# Altium project si4735_RX_MIET.PrjPcb
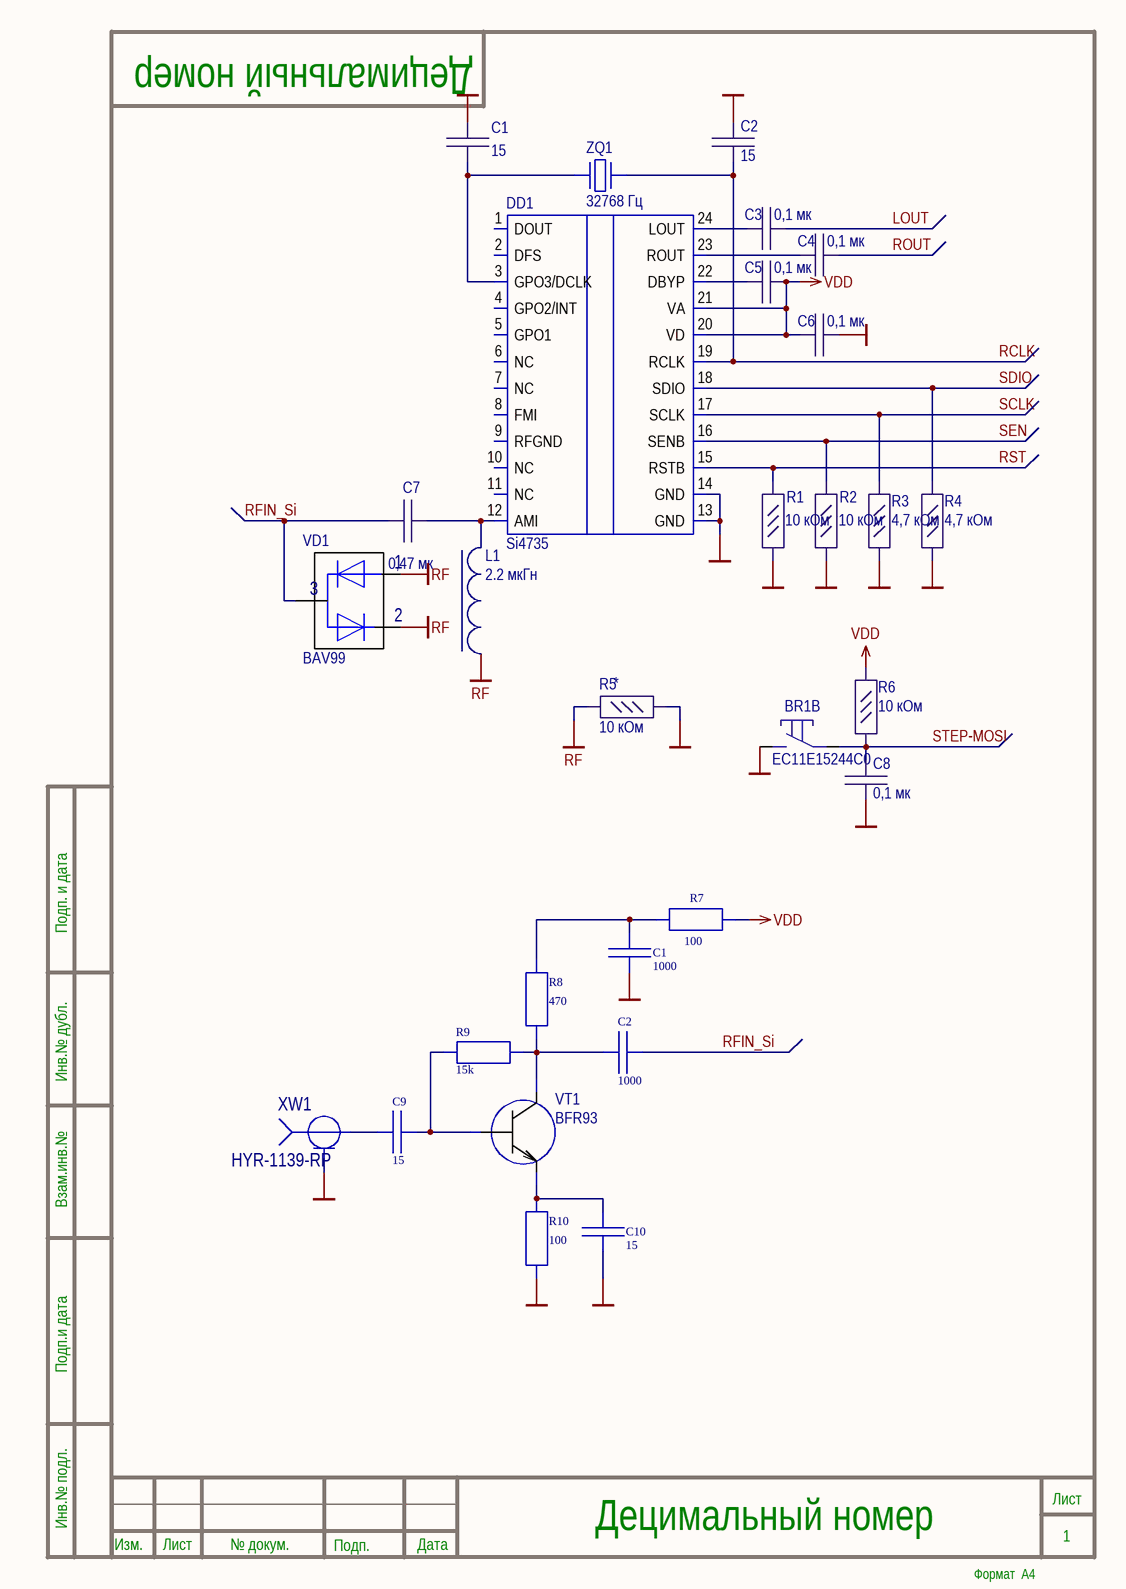
[diagram p0: RF.SchDoc]
5 sheets, 77 parts. Net scope: global (net labels, ports and power ports of the same name join across sheets).
Board file: PCB1.PcbDoc
Sheets:
  MAIN.SchDoc
  RF.SchDoc
  MCU.SchDoc
  AUDIO.SchDoc
  PWR.SchDoc

## Sheet MAIN.SchDoc: Наименование
size 209 x 297 mm; ApprovedBy: Утвердил; CheckedBy: Проверил; Author: Разработал; CompanyName: Организация; DrawnBy: Н.Контр; Engineer: Т.Контр; SheetNumber: 1; SheetTotal: 1; PageSetup: Record=PageOptions|CenterHorizontal=True|CenterVertical=True|PrintScale=0.94|XCorrection=1.00|YCorrection=1.00|PrintKind=1|BorderSize=5000000|LeftOffset=0|BottomOffset=0|Orientation=1|PaperLength=1000|PaperWidth=1000|Scale=100|PaperSource=7|PrintQuality=-4|MediaType=1|DitherType=10|PaperKind=A4|PrintScaleMode=1; DecimalNumber: Децимальный номер; HeadOfSector: Нач. сектора; MainDevice: Перв.примен.; Name: Наименование; DocumentName: Sheet1.SCHDOC

### Notes on the sheet
- Перв.примен.
- Справ.№
- Подп. и дата
- Инв.№ дубл.
- Взам.инв.№
- Подп.и дата
- Разраб.
- Изм.
- Лист
- № докум.
- Подп.
- Дата
- Лит.
- Масштаб
- Масса
- Т.контр.
- Пров.
- ПРИНЦИПИАЛЬНАЯ
- СХЕМА   ЭЛЕКТРИЧЕСКАЯ
- Листов
- Инв.№ подл.
- Утв.
- Н.контр.
- Нач.сект.
- Копировал
- Формат  A3

## Sheet RF.SchDoc: Наименование
size 209 x 297 mm; ApprovedBy: Утвердил; CheckedBy: Проверил; Author: Разработал; CompanyName: Организация; DrawnBy: Н.Контр; Engineer: Т.Контр; SheetNumber: 1; SheetTotal: 1; PageSetup: Record=PageOptions|CenterHorizontal=True|CenterVertical=True|PrintScale=0.94|XCorrection=1.00|YCorrection=1.00|PrintKind=1|BorderSize=5000000|LeftOffset=0|BottomOffset=0|Orientation=1|PaperLength=1000|PaperWidth=1000|Scale=100|PaperSource=7|PrintQuality=-4|MediaType=1|DitherType=10|PaperKind=A4|PrintScaleMode=1; DecimalNumber: Децимальный номер; HeadOfSector: Нач. сектора; MainDevice: Перв.примен.; Name: Наименование; DocumentName: Sheet1.SCHDOC

### Parts
BR1  EC11E15244C0  [EC11]  (part B of 2)
C1  15  [C_0603]
C2  15  [C_0603]
C3  0,1 мк  [C_0603]
C4  0,1 мк  [C_0603]
C5  0,1 мк  [C_0603]
C6  0,1 мк  [C_0603]
C7  0,47 мк  [C_0603]
C8  0,1 мк  [C_0603]
C9  15  [C_0603]
C10  15  [C_0603]
DD1  Si4735  [SSOP-24]
L1  2.2 мкГн  [LQW18A]
R1  10 кОм  [R_0603]
R2  10 кОм  [R_0603]
R3  4,7 кОм  [R_0603]
R4  4,7 кОм  [R_0603]
R5  10 кОм  [R_0603]
R6  10 кОм  [R_0603]
R7  100  [R_0603]
R8  470  [R_0603]
R9  15k  [R_0603]
R10  100  [R_0603]
VD1  BAV99  [SOT23]
VT1  BFR93  [BFR93 SOT95P230X110-3L]
XW1  HYR-1139-RP  [SMA (HYR1139)]
ZQ1  32768 Гц  [DT-38T]
С1  1000  [C_0603]
С2  1000  [C_0603]

### Nets
GND: BR1.D C1.2 C2.2 C6.1 C8.2 C10.1 DD1.13(GND) DD1.14(GND) R1.1 R2.1 R3.1 R4.1 R5.1 R10.1 XW1.1 С1.1
RF: L1.1 R5.2 VD1.1(A1) VD1.2(C2)
VDD: C5.1 C6.2 DD1.20(VD) DD1.21(VA) R6.1 R7.2
LOUT: C3.1
RCLK: C2.1 DD1.19(RCLK) ZQ1.1
RFIN_Si: C7.1 VD1.3(C1A2) С2.1
ROUT: C4.1
RST: DD1.15(RSTB) R1.2
SCLK: DD1.17(SCLK) R3.2
SDIO: DD1.18(SDIO) R4.2
SEN: DD1.16(SENB) R2.2
STEP-MOSI: BR1.E C8.1 R6.2
NetC1_1: C1.1 DD1.3(GPO3/DCLK) ZQ1.2
NetC3_2: C3.2 DD1.24(LOUT)
NetC4_2: C4.2 DD1.23(ROUT)
NetC5_2: C5.2 DD1.22(DBYP)
NetC7_2: C7.2 DD1.12(AMI) L1.2
NetC9_1: C9.1 XW1.2
NetC9_2: C9.2 R9.1 VT1.1(B)
NetC10_2: C10.2 R10.2 VT1.2(E)
NetR7_1: R7.1 R8.2 С1.2
NetR8_1: R8.1 R9.2 VT1.3(C) С2.2

Not connected (* = marked no-connect by the designer): DD1 1(DOUT) 2(DFS) 4(GPO2/INT) 5(GPO1) 6(NC) 7(NC) 8(FMI) 9(RFGND) 10(NC) 11(NC)

### Notes on the sheet
- (near R5) *
- Подп. и дата
- Инв.№ дубл.
- Взам.инв.№
- Подп.и дата
- Инв.№ подл.
- Изм.
- Лист
- № докум.
- Подп.
- Дата
- Формат  A4

### Library data of the parts
C1 C2 = GRM1885C1H150FA01D: CAP CER 15PF 50V C0G/NP0 0603; Manufacturer: Murata Electronics; Part Number: GRM1885C1H150FA01D; Value: 15pF; ComponentLink1URL: https://www.murata.com/~/media/webrenewal/support/library/catalog/products/capacitor/mlcc/c02e.ashx?la=en-us; ComponentLink1Description: Datasheet; Component Type: Capasitor
C3-C6 C8 = GRM188R72A104MA35D: CAP CER 0.1UF 100V X7R 0603; Manufacturer: Murata Electronics; Value: 0.1µF; Part Number: GRM188R72A104MA35D; ComponentLink1URL: https://search.murata.co.jp/Ceramy/image/img/A01X/G101/ENG/GRM188R72A104MA35-01.pdf; ComponentLink1Description: Datasheet; Component Type: Capasitor
C7 = GRM188R71E474KA12D: CAP CER 0.47UF 25V X7R 0603; Manufacturer: Murata Electronics; Value: 0.47µF; Part Number: GRM188R71E474KA12D; ComponentLink1URL: https://www.murata.com/~/media/webrenewal/support/library/catalog/products/capacitor/mlcc/c02e.ashx?la=en-us; ComponentLink1Description: Datasheet; Component Type: Capasitor
C9 C10 = 06035C100KAT2A: Cap. 15 pF, 0603
DD1 = Si4735: BROADCAST AM/FM/SW/LW RADIO RECEIVER
L1 = LQW18ANR22G: 0.22 мкГн, 0603, 2%
R1 R2 R5 R6 = CR0603-FX-1002ELF: RES SMD 10K OHM 1% 1/10W 0603; Manufacturer: Bourns Inc.; Part Number: CR0603-FX-1002ELF; Value: 10 кОм; ComponentLink1URL: https://www.bourns.com/pdfs/chpreztr.pdf; ComponentLink1Description: Datasheet; Component Type: Resistor
R3 R4 = CR0603-FX-4701ELF: RES SMD 4.7K OHM 1% 1/10W 0603; Manufacturer: Bourns Inc.; Part Number: CR0603-FX-4701ELF; Value: 4,7 кОм; ComponentLink1URL: https://www.bourns.com/pdfs/chpreztr.pdf; ComponentLink1Description: Datasheet; Component Type: Resistor
R7 R10 = CR0603-FX-1000ELF: Res. 100 Ohm, 0603
R8 = RC0603JR-07470RL: Res. 470 Ohm, 0603
R9 = RC0603FR-0715KL: Res. 15 kOhm, 0603
ZQ1 = FTX32.768K12.5D8-20D
С1 С2 = 06035A102JAT2A: Cap. 1000nF, 0603
VD1 = BAV99: HelpURL: https://www.vishay.com/docs/85718/bav99.pdf

## Sheet MCU.SchDoc: Наименование
size 209 x 297 mm; ApprovedBy: Утвердил; CheckedBy: Проверил; Author: Разработал; CompanyName: Организация; DrawnBy: Н.Контр; Engineer: Т.Контр; SheetNumber: 1; SheetTotal: 1; PageSetup: Record=PageOptions|CenterHorizontal=True|CenterVertical=True|PrintScale=0.94|XCorrection=1.00|YCorrection=1.00|PrintKind=1|BorderSize=5000000|LeftOffset=0|BottomOffset=0|Orientation=1|PaperLength=1000|PaperWidth=1000|Scale=100|PaperSource=7|PrintQuality=-4|MediaType=1|DitherType=10|PaperKind=A4|PrintScaleMode=1; DecimalNumber: Децимальный номер; HeadOfSector: Нач. сектора; MainDevice: Перв.примен.; Name: Наименование; DocumentName: Sheet1.SCHDOC
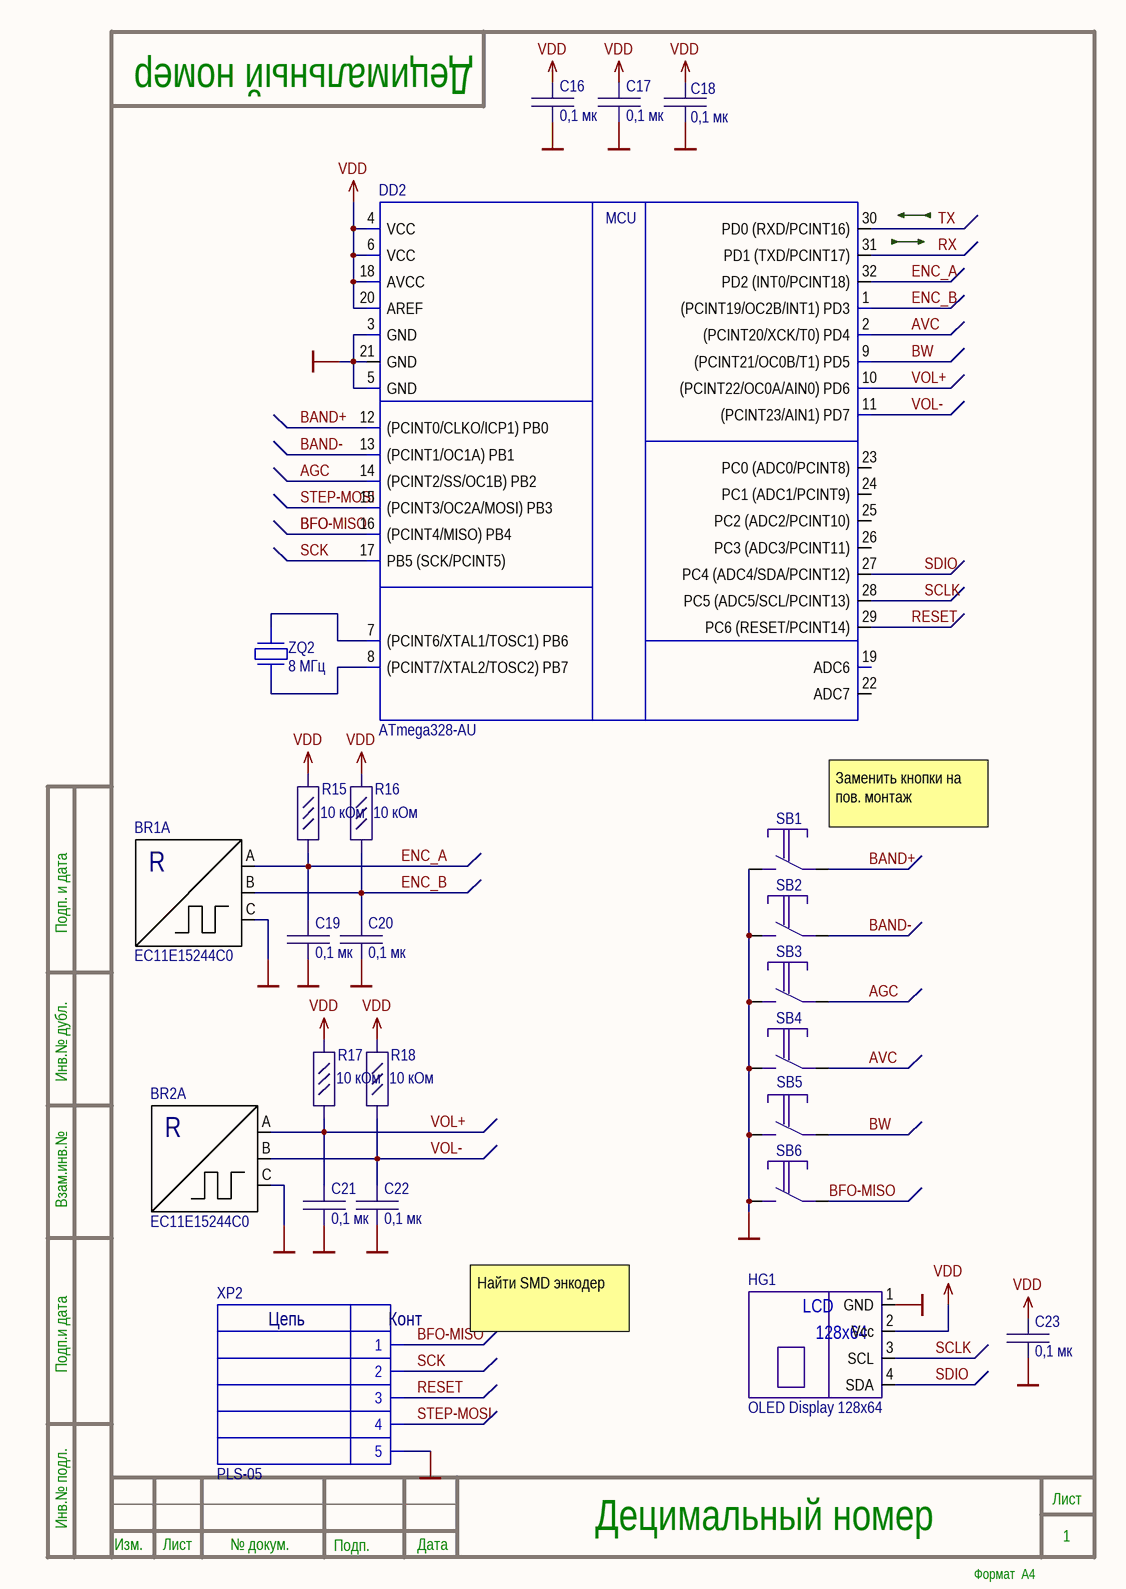
[diagram p1: MCU.SchDoc]

### Parts
BR1  EC11E15244C0  [EC11]  (part A of 2)
BR2  EC11E15244C0  [EC11]  (part A of 2)
C16  0,1 мк  [C_0603]
C17  0,1 мк  [C_0603]
C18  0,1 мк  [C_0603]
C19  0,1 мк  [C_0603]
C20  0,1 мк  [C_0603]
C21  0,1 мк  [C_0603]
C22  0,1 мк  [C_0603]
C23  0,1 мк  [C_0603]
DD2  ATmega328-AU  [TQFP32]
HG1  OLED Display 128x64  [OLED Display 128x64]
R15  10 кОм  [R_0603]
R16  10 кОм  [R_0603]
R17  10 кОм  [R_0603]
R18  10 кОм  [R_0603]
SB1  KLS7-TS6601  [KLS7-TS6601]  (value not drawn)
SB2  KLS7-TS6601  [KLS7-TS6601]  (value not drawn)
SB3  KLS7-TS6601  [KLS7-TS6601]  (value not drawn)
SB4  KLS7-TS6601  [KLS7-TS6601]  (value not drawn)
SB5  KLS7-TS6601  [KLS7-TS6601]  (value not drawn)
SB6  KLS7-TS6601  [KLS7-TS6601]  (value not drawn)
XP2  PLS-05  [PLS-5]
ZQ2  8 МГц  [MJ CRYSTAL]

### Nets
GND: BR1.C BR2.C C16.2 C17.2 C18.2 C19.2 C20.2 C21.2 C22.2 C23.2 DD2.3(GND) DD2.5(GND) DD2.21(GND) HG1.1(GND) SB1.1 SB2.1 SB3.1 SB4.1 SB5.1 SB6.1 XP2.5
VDD: C16.1 C17.1 C18.1 C23.1 DD2.4(VCC) DD2.6(VCC) DD2.18(AVCC) DD2.20(AREF) HG1.2(Vcc) R15.2 R16.2 R17.2 R18.2
AGC: DD2.14((PCINT2/SS/OC1B)_PB2) SB3.2
AVC: DD2.2((PCINT20/XCK/T0)_PD4) SB4.2
BAND+: DD2.12((PCINT0/CLKO/ICP1)_PB0) SB1.2
BAND-: DD2.13((PCINT1/OC1A)_PB1) SB2.2
BFO: DD2.16((PCINT4/MISO)_PB4) SB6.2 XP2.1  [also labelled BFO-MISO]
BW: DD2.9((PCINT21/OC0B/T1)_PD5) SB5.2
ENC_A: BR1.A C19.1 DD2.32(PD2_(INT0/PCINT18)) R15.1
ENC_B: BR1.B C20.1 DD2.1((PCINT19/OC2B/INT1)_PD3) R16.1
RESET: DD2.29(PC6_(RESET/PCINT14)) XP2.3
RX: DD2.31(PD1_(TXD/PCINT17))
SCK: DD2.17(PB5_(SCK/PCINT5)) XP2.2
SCLK: DD2.28(PC5_(ADC5/SCL/PCINT13)) HG1.3(SCL)
SDIO: DD2.27(PC4_(ADC4/SDA/PCINT12)) HG1.4(SDA)
STEP-MOSI: DD2.15((PCINT3/OC2A/MOSI)_PB3) XP2.4
TX: DD2.30(PD0_(RXD/PCINT16))
VOL+: BR2.A C21.1 DD2.10((PCINT22/OC0A/AIN0)_PD6) R17.1
VOL-: BR2.B C22.1 DD2.11((PCINT23/AIN1)_PD7) R18.1
NetDD2_7: DD2.7((PCINT6/XTAL1/TOSC1)_PB6) ZQ2.3
NetDD2_8: DD2.8((PCINT7/XTAL2/TOSC2)_PB7) ZQ2.1

Not connected (* = marked no-connect by the designer): DD2 19(ADC6) 22(ADC7) 23(PC0_(ADC0/PCINT8)) 24(PC1_(ADC1/PCINT9)) 25(PC2_(ADC2/PCINT10)) 26(PC3_(ADC3/PCINT11))

### Notes on the sheet
- Заменить кнопки на пов. монтаж
- Найти SMD энкодер
- Подп. и дата
- Инв.№ дубл.
- Взам.инв.№
- Подп.и дата
- Инв.№ подл.
- Изм.
- Лист
- № докум.
- Подп.
- Дата
- Формат  A4
- (in symbol ATmega328-AU) MCU
- (in symbol EC11E15244C0, part A) R
- (in symbol OLED Display 128x64) LCD; 128x64
- (in symbol PLS-5) Цепь; Конт

### Library data of the parts
C16-C23 = GRM188R72A104MA35D: as C3 on sheet RF; Part Number: GRM188R72A104MA35D; ComponentLink1URL: https://search.murata.co.jp/Ceramy/image/img/A01X/G101/ENG/GRM188R72A104MA35-01.pdf; ComponentLink1Description: Datasheet; Component Type: Capasitor
R15-R18 = CR0603-FX-1002ELF: as R1 on sheet RF; Part Number: CR0603-FX-1002ELF; Value: 10 кОм; ComponentLink1URL: https://www.bourns.com/pdfs/chpreztr.pdf; ComponentLink1Description: Datasheet; Component Type: Resistor
XP2 = PLS-5
ZQ2 = NX5032GA-8MHz

## Sheet AUDIO.SchDoc: Наименование
size 209 x 297 mm; ApprovedBy: Утвердил; CheckedBy: Проверил; Author: Разработал; CompanyName: Организация; DrawnBy: Н.Контр; Engineer: Т.Контр; SheetNumber: 1; SheetTotal: 1; PageSetup: Record=PageOptions|CenterHorizontal=True|CenterVertical=True|PrintScale=0.94|XCorrection=1.00|YCorrection=1.00|PrintKind=1|BorderSize=5000000|LeftOffset=0|BottomOffset=0|Orientation=1|PaperLength=1000|PaperWidth=1000|Scale=100|PaperSource=7|PrintQuality=-4|MediaType=1|DitherType=10|PaperKind=A4|PrintScaleMode=1; DecimalNumber: Децимальный номер; HeadOfSector: Нач. сектора; MainDevice: Перв.примен.; Name: Наименование; DocumentName: Sheet1.SCHDOC
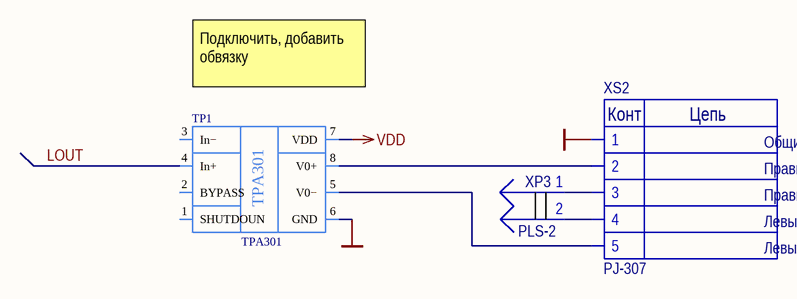
[diagram p2: AUDIO.SchDoc]

### Parts
TP1  TPA301  [TPA301 TSOP65P490X110_HS-9L]
XP3  PLS-2  [PLS-2]
XS2  PJ-307  [PJ-307]

### Nets
GND: TP1.6(GND) XS2.1
VDD: TP1.7(VDD)
LOUT: TP1.4(In+)
NetTP1_5: TP1.5(V0−) XS2.5
NetTP1_8: TP1.8(V0+) XS2.2
NetXP3_1: XP3.1 XS2.3
NetXP3_2: XP3.2 XS2.4

Not connected (* = marked no-connect by the designer): TP1 1(SHUTDOUN) 2(BYPASS) 3(In−)

### Notes on the sheet
- (near TP1) Подключить, добавить обвязку
- Подп. и дата
- Инв.№ дубл.
- Взам.инв.№
- Подп.и дата
- Инв.№ подл.
- Изм.
- Лист
- № докум.
- Подп.
- Дата
- Формат  A4
- (in symbol PJ-307) Конт; Цепь; Общий; Правый; Правый - динамик; Левый - динамик; Левый

## Sheet PWR.SchDoc: Наименование
size 209 x 297 mm; ApprovedBy: Утвердил; CheckedBy: Проверил; Author: Разработал; CompanyName: Организация; DrawnBy: Н.Контр; Engineer: Т.Контр; SheetNumber: 1; SheetTotal: 1; PageSetup: Record=PageOptions|CenterHorizontal=True|CenterVertical=True|PrintScale=0.94|XCorrection=1.00|YCorrection=1.00|PrintKind=1|BorderSize=5000000|LeftOffset=0|BottomOffset=0|Orientation=1|PaperLength=1000|PaperWidth=1000|Scale=100|PaperSource=7|PrintQuality=-4|MediaType=1|DitherType=10|PaperKind=A4|PrintScaleMode=1; DecimalNumber: Децимальный номер; HeadOfSector: Нач. сектора; MainDevice: Перв.примен.; Name: Наименование; DocumentName: Sheet1.SCHDOC
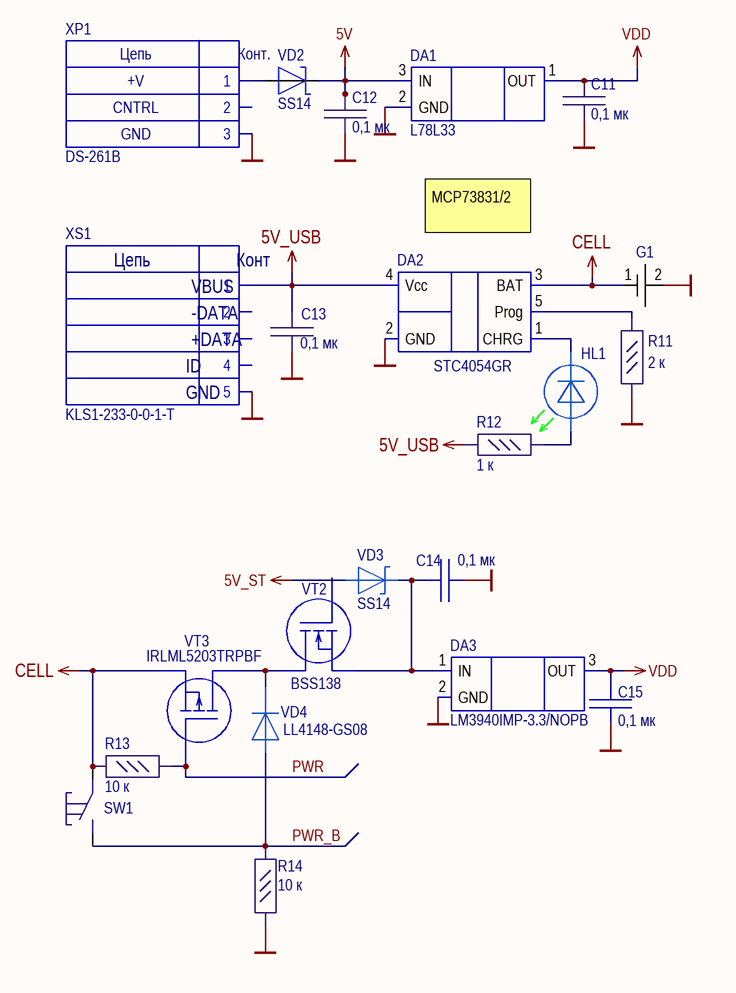
[diagram p3: PWR.SchDoc]

### Parts
C11  0,1 мк  [C_0603]
C12  0,1 мк  [C_0603]
C13  0,1 мк  [C_0603]
C14  0,1 мк  [C_0805]
C15  0,1 мк  [C_0805]
DA1  L78L33  [SOT89]
DA2  STC4054GR  [TSOT23-5L]
DA3  LM3940IMP-3.3/NOPB  [SOT223]
G1  12BHC186P1-GR  [12BHC186P1-GR]  (value not drawn)
HL1  BL-HGK36G  [LED_0603_GREEN]  (value not drawn)
R11  2 к  [R_0603]
R12  1 к  [R_0603]
R13  10 к  [R_0603]
R14  10 к  [R_0603]
SW1  KLS7-TS6604  [KLS7-TS6604-5.0-180-B]  (value not drawn)
VD2  SS14  [DO-214AC]
VD3  SS14  [DO-214AC]
VD4  LL4148-GS08  [SOD-80]
VT2  BSS138  [SOT23]
VT3  IRLML5203TRPBF  [SOT23]
XP1  DS-261B  [DS-261]
XS1  KLS1-233-0-0-1-T  [KLS1-233-0-0-1-T]

### Nets
5V: C12.1 DA1.3(IN) VD2.2
5V_ST: VD3.1
5V_USB: C13.2 DA2.4(Vcc) R12.2 XS1.1
CELL: DA2.3(BAT) G1.1 R13.1 SW1.2 VT3.2(S)
GND: C11.2 C12.2 C13.1 C14.2 C15.1 DA1.2(GND) DA2.2(GND) DA3.2(GND) G1.2 R11.1 R14.1 XP1.3 XS1.5
VDD: C11.1 C15.2 DA1.1(OUT) DA3.3(OUT)
PWR: R13.2 VT3.1(G)
PWR_B: R14.2 SW1.1 VD4.1
NetC14_1: C14.1 DA3.1(IN) VD3.2 VT2.2(S)
NetDA2_1: DA2.1(CHRG) HL1.2
NetDA2_5: DA2.5(Prog) R11.2
NetHL1_1: HL1.1 R12.1
NetVD2_1: VD2.1 XP1.1
NetVD4_2: VD4.2 VT2.3(D) VT3.3(D)

Not connected (* = marked no-connect by the designer): VT2 1(G); XP1 2; XS1 2 3 4

### Notes on the sheet
- MCP73831/2
- Перв.примен.
- Справ.№
- Подп. и дата
- Инв.№ дубл.
- Взам.инв.№
- Подп.и дата
- Разраб.
- Изм.
- Лист
- № докум.
- Подп.
- Дата
- Лит.
- Масштаб
- Масса
- Т.контр.
- Пров.
- ПРИНЦИПИАЛЬНАЯ
- СХЕМА   ЭЛЕКТРИЧЕСКАЯ
- Листов
- Инв.№ подл.
- Утв.
- Н.контр.
- Нач.сект.
- Копировал
- Формат  A3
- (in symbol DS-261B) Цепь; Конт.; +V; CNTRL; GND
- (in symbol KLS1-233-0-0-1-T) Цепь; Конт; VBUS; -DATA; +DATA; ID; GND

### Library data of the parts
C11-C13 = GRM188R72A104MA35D: as C3 on sheet RF; Part Number: GRM188R72A104MA35D; ComponentLink1URL: https://search.murata.co.jp/Ceramy/image/img/A01X/G101/ENG/GRM188R72A104MA35-01.pdf; ComponentLink1Description: Datasheet; Component Type: Capasitor
C14 C15 = C_0805
DA1 = L78L33ABUTR
DA2 = STC4054GR: Контроллер заряда Lion батарей
DA3 = LM3940IMP-3.3/NOPB: Регулятор с малым падением напряжения, преобразование 5В в 3.3В/ 1А
G1 = 12BHC186P1-GR: Батарейный отсек 1x18650
R11 = CR0603-FX-2001ELF: RES SMD 2K OHM 1% 1/10W 0603; Manufacturer: Bourns Inc.; Part Number: CR0603-FX-2001ELF; Value: 2 к; ComponentLink1URL: https://www.bourns.com/pdfs/chpreztr.pdf; ComponentLink1Description: Datasheet; Component Type: Resistor
R12 = CR0603-FX-1001ELF: RES SMD 1K OHM 1% 1/10W 0603; Manufacturer: Bourns Inc.; Part Number: CR0603-FX-1001ELF; Value: 1 к; ComponentLink1URL: https://www.bourns.com/pdfs/chpreztr.pdf; ComponentLink1Description: Datasheet; Component Type: Resistor
R13 R14 = CR0603-FX-1002ELF: as R1 on sheet RF; Part Number: CR0603-FX-1002ELF; Value: 10 к; ComponentLink1URL: https://www.bourns.com/pdfs/chpreztr.pdf; ComponentLink1Description: Datasheet; Component Type: Resistor
VD4 = LL4148-GS08: Диод
VT2 = BSS138: MOSFET, N-канал, 0.2А, 50В
VT3 = IRLML5203TRPBF: Транзистор, P-канал 30В 3A logic

## Nets that join several sheets
GND: RF (16 pins), MCU (21 pins), AUDIO (TP1.6 XS2.1), PWR (13 pins)
VDD: RF (6 pins), MCU (13 pins), AUDIO (TP1.7), PWR (C11.1 C15.2 DA1.1 DA3.3)
LOUT: RF (C3.1), AUDIO (TP1.4)
SCLK: RF (DD1.17 R3.2), MCU (DD2.28 HG1.3)
SDIO: RF (DD1.18 R4.2), MCU (DD2.27 HG1.4)
STEP-MOSI: RF (BR1.E C8.1 R6.2), MCU (DD2.15 XP2.4)